# EAGLE design sensor-weather-perfboard (EAGLE 9.6.2)
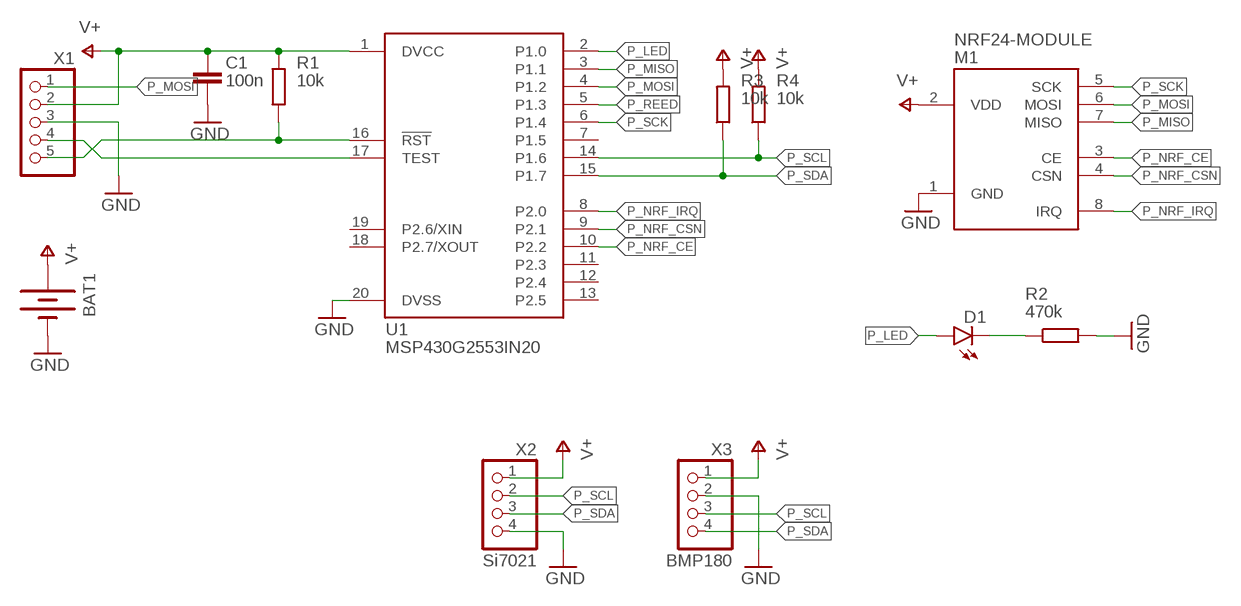
[diagram p0: schematic, sheet 1]

## Parts
BAT1  BATTERY20PTH  [BATTCOM_20MM_PTH]
C1  100n  C0603  [C0603]
D1  LED5MM  [LED5MM]
M1  NRF24-MODULE  [NRF24-MODULE]
R1  10k  R0603  [R0603]
R2  470k  R0603  [R0603]
R3  10k  R0603  [R0603]
R4  10k  R0603  [R0603]
U1  MSP430G2553IN20  [DIL20]
X1  PINHD_5_RND  [1X05]
X2  Si7021  PINHD_4_RND  [1X04]
X3  BMP180  PINHD_4_RND  [1X04]

## Nets
GND: BAT1.2(-) C1.2 M1.1(GND) R2.2 U1.20(DVSS) X1.3 X2.4 X3.2
N$1: D1.K(C) R2.1
N$2: R1.1 U1.16(!RST!) X1.5
N$3: U1.17(TEST) X1.4
P_LED: D1.A U1.2(P1.0)
P_MISO: M1.7(MISO) U1.3(P1.1)
P_MOSI: M1.6(MOSI) U1.4(P1.2) X1.1
P_NRF_CE: M1.3(CE) U1.10(P2.2)
P_NRF_CSN: M1.4(CSN) U1.9(P2.1)
P_NRF_IRQ: M1.8(IRQ) U1.8(P2.0)
P_REED: U1.5(P1.3)
P_SCK: M1.5(SCK) U1.6(P1.4)
P_SCL: R4.1 U1.14(P1.6) X2.2 X3.3
P_SDA: R3.1 U1.15(P1.7) X2.3 X3.4
V+: BAT1.1(+) C1.1 M1.2(VDD) R1.2 R3.2 R4.2 U1.1(DVCC) X1.2 X2.1 X3.1
Unconnected: U1.7(P1.5) U1.11(P2.3) U1.12(P2.4) U1.13(P2.5) U1.18(P2.7/XOUT) U1.19(P2.6/XIN)

## Library data of the parts
BAT1 = SparkFun-Electromechanical:BATTERY: Battery Holders Various common sizes : AA, AAA, 18650 (PRT-12895), 20mm coin cell and 12mm coin cell. 20MM_4LEGS, BATT-10373
C1 = rfr-lib-passive:C: Standard-SMD-Kondensatoren
D1 = led:LED: LED OSRAM: - CHIPLED LG R971, LG N971, LY N971, LG Q971, LY Q971, LO R971, LY R971 LH N974, LH R974 LS Q976, LO Q976, LY Q976 LO Q996 - Hyper CHIPLED LW Q18S LB Q993, LB Q99A, LB R99A - SideLED LS A670, LO A670, LY A670, LG A670, LP A670 LB A673, LV A673, LT A673, LW A673 LH A674 LY A675 LS A676, LA A676, LO A676, LY A676, LW A676 LS A679, LY A679, LG A679 - Hyper Micro SIDELED® LS Y876, LA Y876, LO Y876, LY Y876 LT Y87S - SmartLED LW L88C, LW L88S LB L89C, LB L89S, LG L890 LS L89K, LO L89K, LY L89K LS L896, LA L896, LO L896, LY L896 - TOPLED LS T670, LO T670, LY T670, LG T670, LP T670 LSG T670, LSP T670, LSY T670, LOP T670, LYG T670 LG T671, LOG T671, LSG T671 LB T673, LV T673, LT T673, LW T673 LH T674 LS T676, LA T676, LO T676, LY T676, LB T676, LH T676, LSB T676, LW T676 LB T67C, LV T67C, LT T67C, LS T67K, LO T67K, LY T67K, LW E67C LS E67B, LA E67B, LO E67B, LY E67B, LB E67C, LV E67C, LT E67C LW T67C LS T679, LY T679, LG T679 LS T770, LO T770, LY T770, LG T770, LP T770 LB T773, LV T773, LT T773, LW T773 LH T774 LS E675, LA E675, LY E675, LS T675 LS T776, LA T776, LO T776, LY T776, LB T776 LHGB T686 LT T68C, LB T68C - Hyper Mini TOPLED® LB M676 - Mini TOPLED Santana® LG M470 LS M47K, LO M47K, LY M47K Source: http://www.osram.convergy.de LUXEON: - LUMILED® LXK2-PW12-R00, LXK2-PW12-S00, LXK2-PW14-U00, LXK2-PW14-V00 LXK2-PM12-R00, LXK2-PM12-S00, LXK2-PM14-U00 LXK2-PE12-Q00, LXK2-PE12-R00, LXK2-PE12-S00, LXK2-PE14-T00, LXK2-PE14-U00 LXK2-PB12-K00, LXK2-PB12-L00, LXK2-PB12-M00, LXK2-PB14-N00, LXK2-PB14-P00, LXK2-PB14-Q00 LXK2-PR12-L00, LXK2-PR12-M00, LXK2-PR14-Q00, LXK2-PR14-R00 LXK2-PD12-Q00, LXK2-PD12-R00, LXK2-PD12-S00 LXK2-PH12-R00, LXK2-PH12-S00 LXK2-PL12-P00, LXK2-PL12-Q00, LXK2-PL12-R00 Source: www.luxeon.com KINGBRIGHT: KA-3528ASYC Source: www.kingbright.com
M1 = msp430-nrf-wsn-lib:NRF24-MODULE
R1-R4 = rfr-lib-passive:R: Standard-SMD-Widerstände
U1 = rfr-lib-digital:MSP430G2553: MSP430G2XX1 TSSOP (PW) 20 Pin Package
X1 = rfr-lib-connector:PINHD_5_RND
X2 X3 = rfr-lib-connector:PINHD_4_RND

## Board
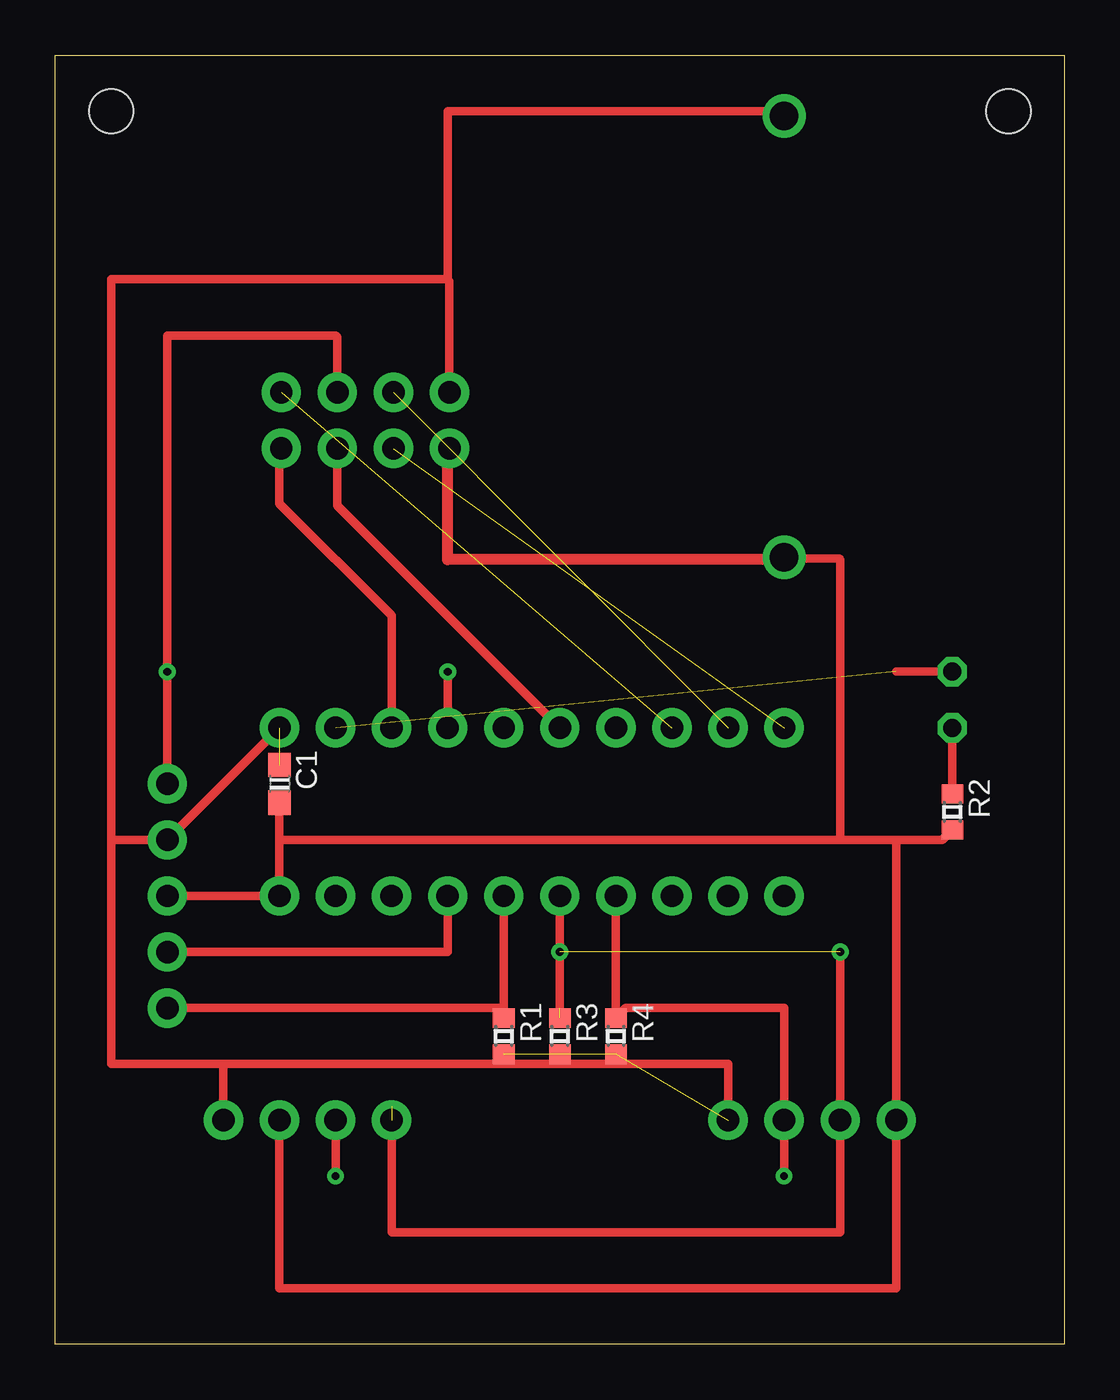
[diagram p1: board, top side]
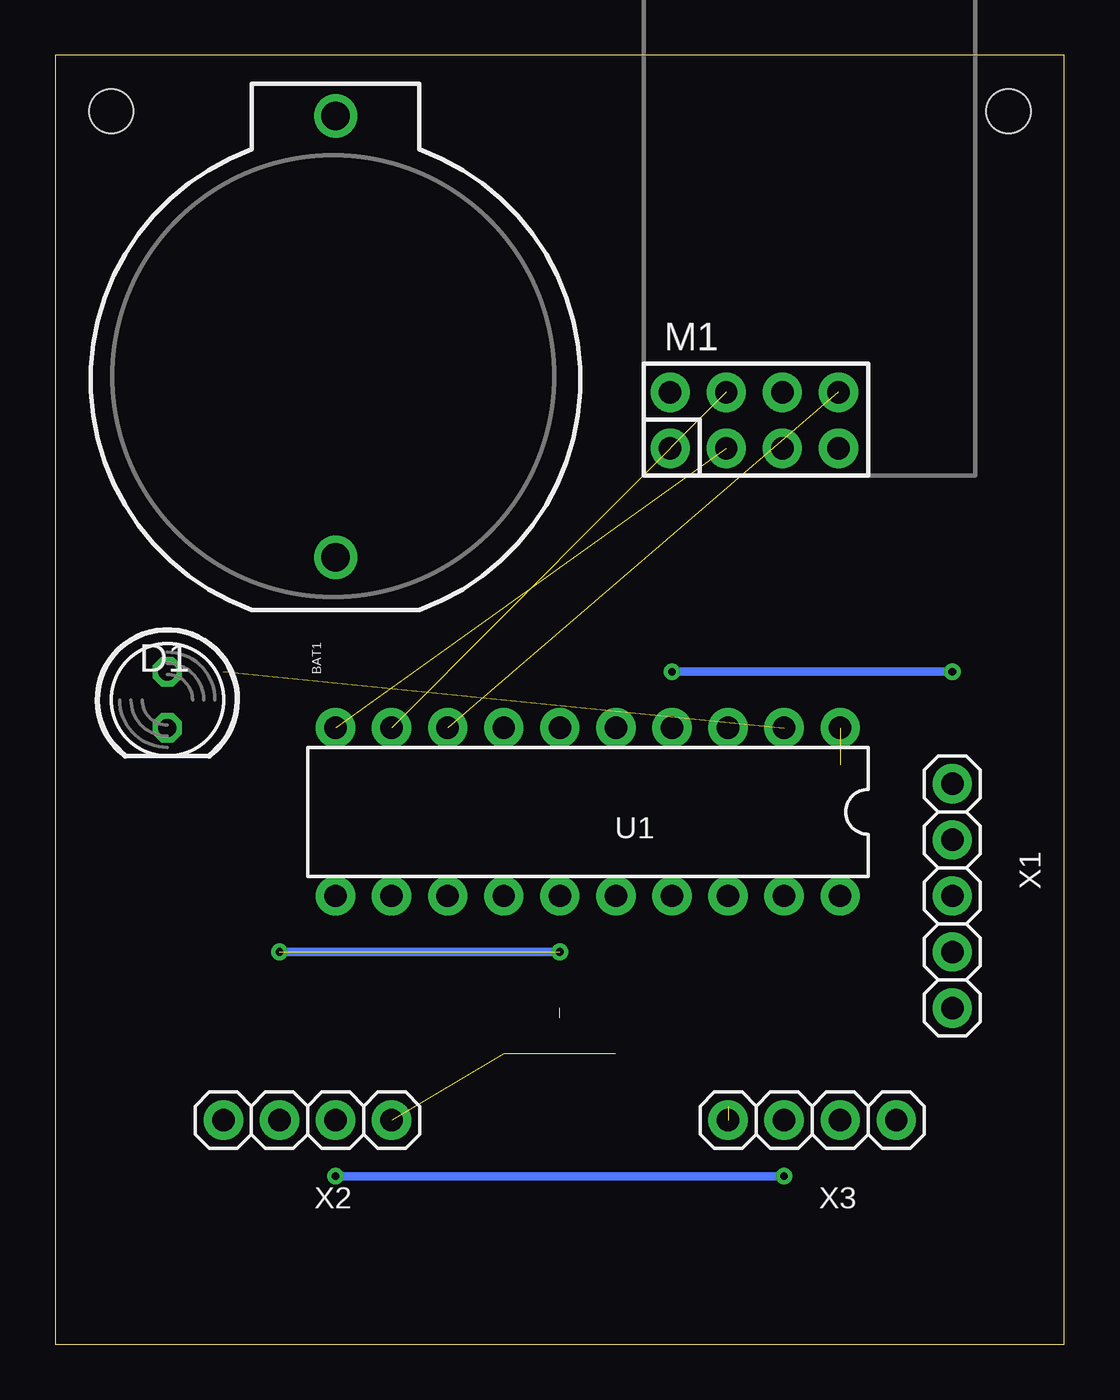
[diagram p2: board, bottom side, seen from below]

Size 45.72 x 58.42 mm. Coordinates in mm from the lower left corner, seen from the top.
Outline: 45.72,0 0,0 0,58.42 45.72,58.42 45.72,0
Copper layers (1*16): Top 0.035mm / dielectric 1.5mm / Bottom 0.035mm
Design rules "default": minimum track width 6mil, minimum drill 0.35mm, track to track 6mil, track to pad 6mil, pad to pad 6mil, via to via 6mil, smd to smd 6mil, copper to edge 40mil, drill to drill 6mil, minimum pad ring 10mil, minimum via ring 8mil, stop-mask expansion 4mil, vias tented up to drill 0mil, thermal gap 10mil
Holes 2 mm at 2.54,55.88 43.18,55.88

### Footprints (pad centres in the part's own frame; a part is rotated, then mirrored left to right if it is on the bottom)
BATTCOM_20MM_PTH = drill 1.3: 1 11.85,0; 2 -8.15,0
C0603 = smd 1.1 x 1: 1 -0.85,0; 2 0.85,0
LED5MM = drill 0.813 octagon: A -1.27,0; K 1.27,0
NRF24-MODULE = drill 1.016 pad 1.778: 1 1.19,1.23; 2 1.19,3.77; 3 3.73,1.23; 4 3.73,3.77; 5 6.27,1.23; 6 6.27,3.77; 7 8.81,1.23; 8 8.81,3.77
R0603 = smd 0.87 x 0.98: 1 -0.815,0; 2 0.815,0
DIL20 = drill 1.016 pad 1.778: 1 -11.43,-3.81; 2 -8.89,-3.81; 3 -6.35,-3.81; 4 -3.81,-3.81; 5 -1.27,-3.81; 6 1.27,-3.81; 7 3.81,-3.81; 8 6.35,-3.81; 9 8.89,-3.81; 10 11.43,-3.81; 11 11.43,3.81; 12 8.89,3.81; 13 6.35,3.81; 14 3.81,3.81; 15 1.27,3.81; 16 -1.27,3.81; 17 -3.81,3.81; 18 -6.35,3.81; 19 -8.89,3.81; 20 -11.43,3.81
1X05 = drill 1.016 pad 1.778: 1 -5.08,0; 2 -2.54,0; 3 0,0; 4 2.54,0; 5 5.08,0
1X04 = drill 1.016 pad 1.778: 1 -3.81,0; 2 -1.27,0; 3 1.27,0; 4 3.81,0

### Placement (x,y rotation side)
BAT1  33.02,43.81 90 bottom
C1  10.16,25.4 270 top
D1  40.64,29.21 270 bottom
M1  19.05,39.37 0 bottom
R1  20.32,13.97 270 top
R2  40.64,24.13 270 top
R3  22.86,13.97 270 top
R4  25.4,13.97 270 top
U1  21.59,24.13 180 bottom
X1  5.08,20.32 270 bottom
X2  34.29,10.16 180 bottom
X3  11.43,10.16 180 bottom

### Tracks (layer width: path | path; a pad name or v marks a point on that pad's centre or on a via)
GND
  Top 0.381: X1.3 U1.20 10.16,22.86 | 10.16,22.86 35.56,22.86 | C1.2 10.16,22.86 | 35.56,22.86 35.56,35.56 35.51,35.61 32.97,35.61 | R2.2 40.19,22.86 38.1,22.86 | 38.1,22.86 35.56,22.86 | X3.2 10.16,2.54 38.1,2.54 X2.4 38.1,22.86
  Top 0.508: BAT1.2 32.97,35.61 32.91,35.56 17.78,35.56 17.78,40.52 M1.1
N$1
  Top 0.381: D1.K R2.1
N$2
  Top 0.381: X1.5 20.32,15.24 | 20.32,15.24 U1.16 | R1.1 20.32,15.24
N$3
  Top 0.381: X1.4 17.78,17.78 U1.17
P_LED  (1 unrouted)
  Top 0.381: D1.A 38.1,30.48
P_MISO
  Top 0.381: U1.3 15.24,33.02 10.16,38.1 10.16,40.52 M1.7
P_MOSI  (via drill 0.35)
  Top 0.381: M1.6 12.78,45.64 12.7,45.72 5.08,45.72 v5.08,30.48 X1.1 | U1.4 v17.78,30.48
  Bottom 0.381: v17.78,30.48 v5.08,30.48
P_NRF_CE  (1 unrouted)
P_NRF_CSN  (1 unrouted)
P_NRF_IRQ  (1 unrouted)
P_SCK
  Top 0.381: M1.5 12.78,38.02 U1.6
P_SCL  (via drill 0.35)
  Top 0.381: U1.14 R4.1 25.86,15.24 33.02,15.24 X2.2 v33.02,7.62 | v12.7,7.62 X3.3
  Bottom 0.381: v33.02,7.62 v12.7,7.62
P_SDA  (via drill 0.35)  (3 unrouted)
  Top 0.381: U1.15 v22.86,17.78 22.86,15.24 | 15.24,10.79 15.24,5.08 35.56,5.08 X2.3 v35.56,17.78
  Bottom 0.381: v35.56,17.78 v22.86,17.78
V+  (4 unrouted)
  Top 0.381: U1.1 X1.2 2.54,22.86 | 2.54,22.86 2.54,12.7 7.62,12.7 | 2.54,22.86 2.54,48.26 17.78,48.26 | 17.78,48.26 17.86,48.18 M1.2 | 17.78,48.26 17.78,55.88 32.8,55.88 BAT1.1 | X3.1 7.62,12.7 | 7.62,12.7 30.48,12.7 X2.1